# EAGLE design Sensoray_Breakout_26 (EAGLE 7.1.0)
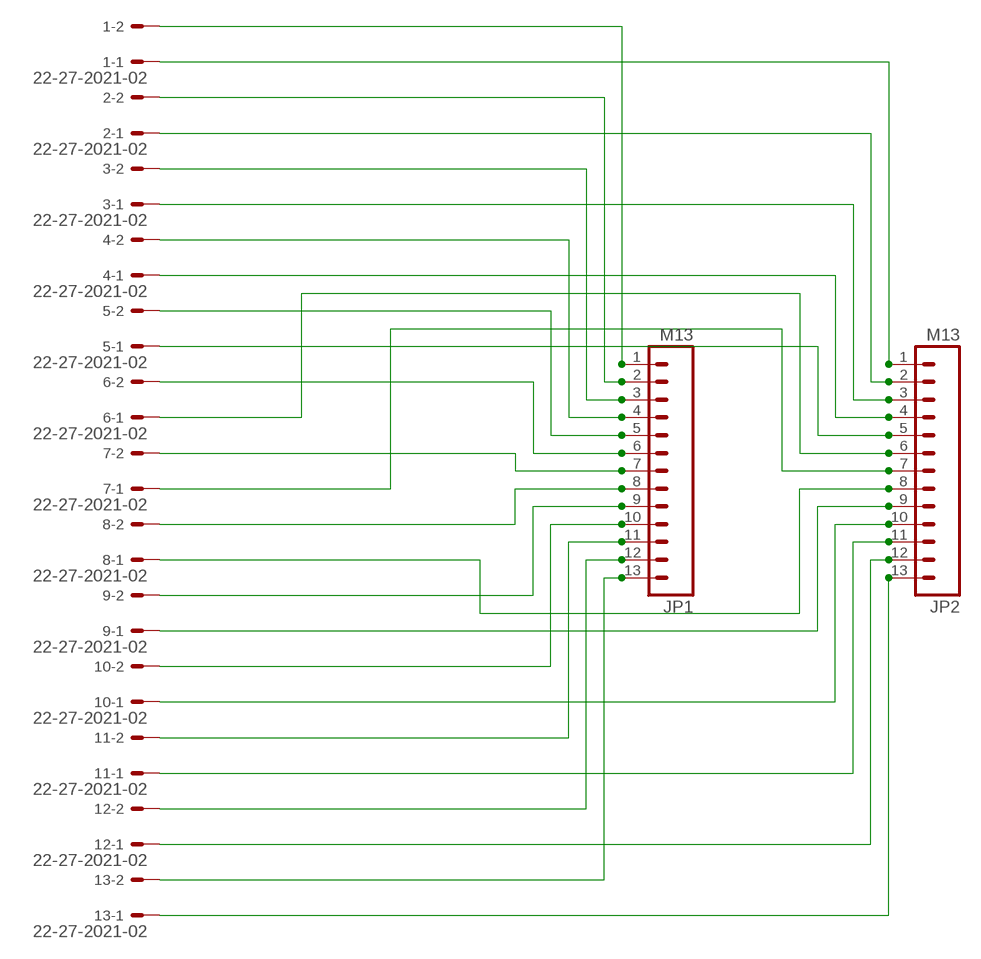
[diagram p0: schematic, sheet 1]

## Parts
1  22-27-2021-02  [6410-02]
2  22-27-2021-02  [6410-02]
3  22-27-2021-02  [6410-02]
4  22-27-2021-02  [6410-02]
5  22-27-2021-02  [6410-02]
6  22-27-2021-02  [6410-02]
7  22-27-2021-02  [6410-02]
8  22-27-2021-02  [6410-02]
9  22-27-2021-02  [6410-02]
10  22-27-2021-02  [6410-02]
11  22-27-2021-02  [6410-02]
12  22-27-2021-02  [6410-02]
13  22-27-2021-02  [6410-02]
JP1  M13  [1X13]
JP2  M13  [1X13]

## Nets
N$1: 1.2 JP1.1
N$2: 2.2 JP1.2
N$3: 3.2 JP1.3
N$4: 4.2 JP1.4
N$5: 5.2 JP1.5
N$6: 6.2 JP1.6
N$7: 7.2 JP1.7
N$8: 8.2 JP1.8
N$9: 9.2 JP1.9
N$10: 10.2 JP1.10
N$11: 11.2 JP1.11
N$12: 12.2 JP1.12
N$13: 13.2 JP1.13
N$14: 1.1 JP2.1
N$15: 2.1 JP2.2
N$16: 3.1 JP2.3
N$17: 4.1 JP2.4
N$18: 5.1 JP2.5
N$19: 6.1 JP2.6
N$20: 7.1 JP2.7
N$21: 13.1 JP2.13
N$22: 12.1 JP2.12
N$23: 11.1 JP2.11
N$24: 10.1 JP2.10
N$25: 9.1 JP2.9
N$26: 8.1 JP2.8

## Library data of the parts
1-13 = con-molex:22-?-02: CONNECTOR wire to board 2.54 mm (.1 inch) pitch header; OC_FARNELL: unknown; OC_NEWARK: unknown
JP1 JP2 = SparkFun-Connectors:M13: 13-pin single row .1" header

## Board
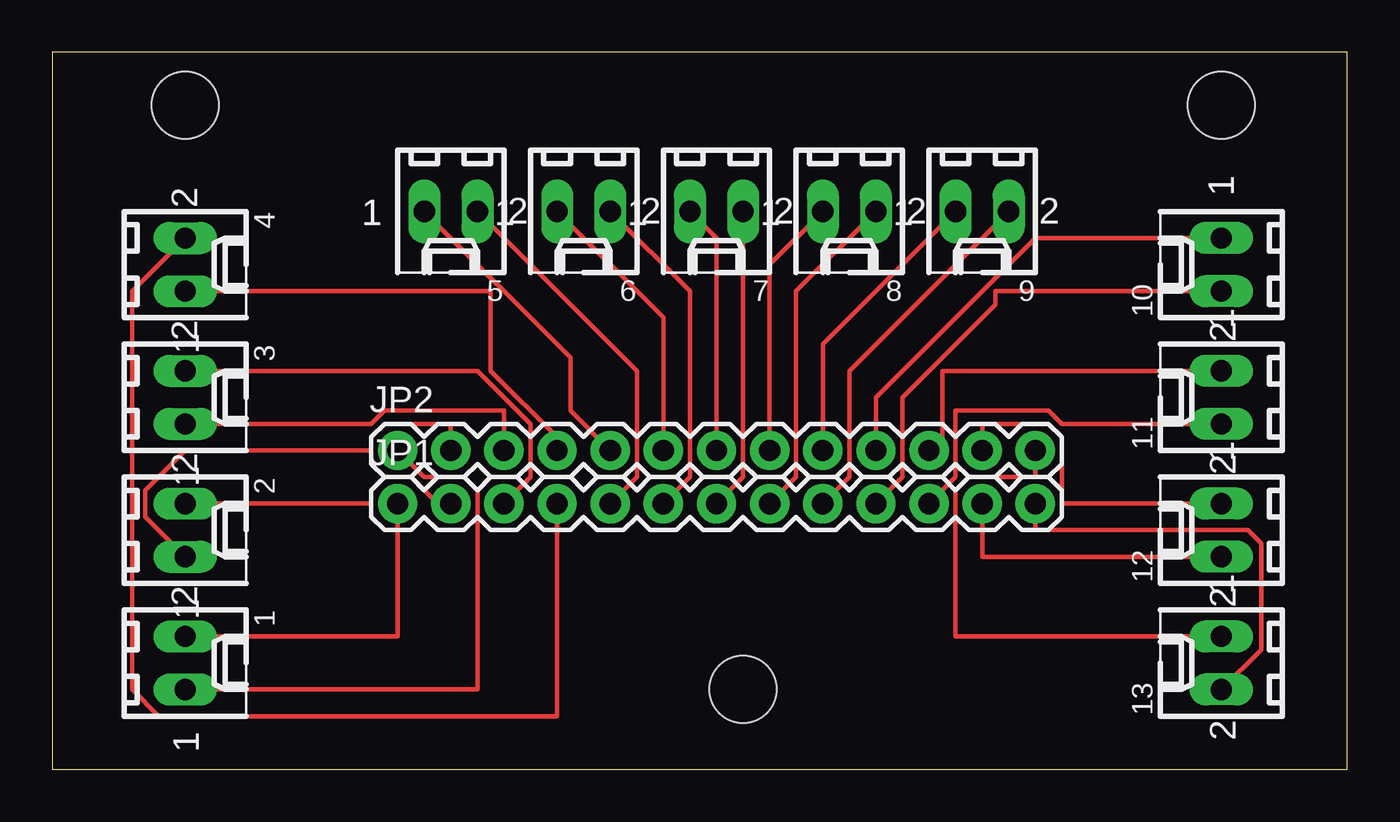
[diagram p1: board, top side]

Size 61.9 x 34.28 mm. Coordinates in mm from the lower left corner, seen from the top.
Outline: 0,0 61.9,0 61.9,34.28 0,34.28 0,0
Copper layers (1*16): Top 0.0178mm / dielectric 59mil / Bottom 0.0178mm
Design rules "epl-lpkf": minimum track width 8mil, minimum drill 0.35mm, track to track 8mil, track to pad 8mil, pad to pad 8mil, via to via 8mil, smd to smd 8mil, copper to edge 15mil, drill to drill 15mil, minimum pad ring 8mil, minimum via ring 8mil, stop-mask expansion 3mil, vias tented up to drill 0mil, thermal gap 10mil
Holes 3.2 mm at 6.35,31.75 33.02,3.81 55.88,31.75

### Footprints (pad centres in the part's own frame; a part is rotated, then mirrored left to right if it is on the bottom)
6410-02 = drill 1.016 long: 1 1.27,0; 2 -1.27,0
1X13 = drill 1.016 pad 1.88: 1 0,0; 2 2.54,0; 3 5.08,0; 4 7.62,0; 5 10.16,0; 6 12.7,0; 7 15.24,0; 8 17.78,0; 9 20.32,0; 10 22.86,0; 11 25.4,0; 12 27.94,0; 13 30.48,0

### Placement (x,y rotation side)
1  6.35,5.08 270 top
2  6.35,11.43 270 top
3  6.35,17.78 270 top
4  6.35,24.13 270 top
5  19.05,26.67 180 top
6  25.4,26.67 180 top
7  31.75,26.67 180 top
8  38.1,26.67 180 top
9  44.45,26.67 180 top
10  55.88,24.13 90 top
11  55.88,17.78 90 top
12  55.88,11.43 90 top
13  55.88,5.08 90 top
JP1  16.51,12.7 0 top
JP2  16.51,15.24 0 top

### Tracks (layer width: path | path; a pad name or v marks a point on that pad's centre or on a via)
N$1
  Top 0.203: 1.2 16.51,6.35 JP1.1
N$2
  Top 0.203: 2.2 15.24,12.7 15.24,13.34 15.88,13.97 17.14,13.97 18.41,12.7 JP1.2
N$3
  Top 0.203: 3.2 20.32,19.05 22.86,16.51 22.86,13.97 JP1.3
N$4
  Top 0.203: 4.2 3.81,22.86 3.81,3.81 5.08,2.54 24.13,2.54 JP1.4
N$5
  Top 0.203: 5.2 27.94,19.05 27.94,13.97 JP1.5
N$6
  Top 0.203: 6.2 30.48,22.86 30.48,13.97 JP1.6
N$7
  Top 0.203: 7.2 33.02,13.97 JP1.7
N$8
  Top 0.203: 8.2 35.56,22.86 35.56,13.97 JP1.8
N$9
  Top 0.203: 9.2 38.1,19.05 38.1,13.97 JP1.9
N$10
  Top 0.203: 10.2 45.09,22.86 45.09,22.23 40.64,17.78 40.64,13.97 JP1.10
N$11
  Top 0.203: 11.2 48.26,16.51 47.62,17.14 43.18,17.14 43.18,13.97 JP1.11
N$12
  Top 0.203: 12.2 44.45,10.16 JP1.12
N$13
  Top 0.203: 13.2 57.78,5.71 57.78,10.79 57.15,11.43 46.99,11.43 JP1.13
N$14
  Top 0.203: 1.1 20.32,3.81 20.32,13.34 19.68,13.97 17.78,13.97 JP2.1
N$15
  Top 0.203: 2.1 4.45,12.06 4.45,13.34 6.35,15.24 15.24,15.24 15.24,15.88 15.88,16.51 19.05,16.51 JP2.2
N$16
  Top 0.203: 3.1 15.24,16.51 15.88,17.14 21.59,17.14 JP2.3
N$17
  Top 0.203: 4.1 20.95,22.86 20.95,19.05 24.13,15.88 JP2.4
N$18
  Top 0.203: 5.1 24.77,19.68 24.77,17.14 JP2.5
N$19
  Top 0.203: 6.1 29.21,21.59 JP2.6
N$20
  Top 0.203: 7.1 31.75,25.4 JP2.7
N$21
  Top 0.203: 13.1 43.18,6.35 43.18,13.34 43.81,13.97 46.99,13.97 JP2.13
N$22
  Top 0.203: 12.1 48.26,12.7 48.26,15.88 47.62,16.51 44.45,16.51 JP2.12
N$23
  Top 0.203: 11.1 42.55,19.05 42.55,15.88 JP2.11
N$24
  Top 0.203: 10.1 46.99,25.4 39.37,17.78 JP2.10
N$25
  Top 0.203: 9.1 36.83,20.32 JP2.9
N$26
  Top 0.203: 8.1 34.29,24.13 JP2.8